# EAGLE design BBB_Learning_Board_0B (EAGLE 7.3.0)
Learning board for the BeagleBone Black.
REV: 0A
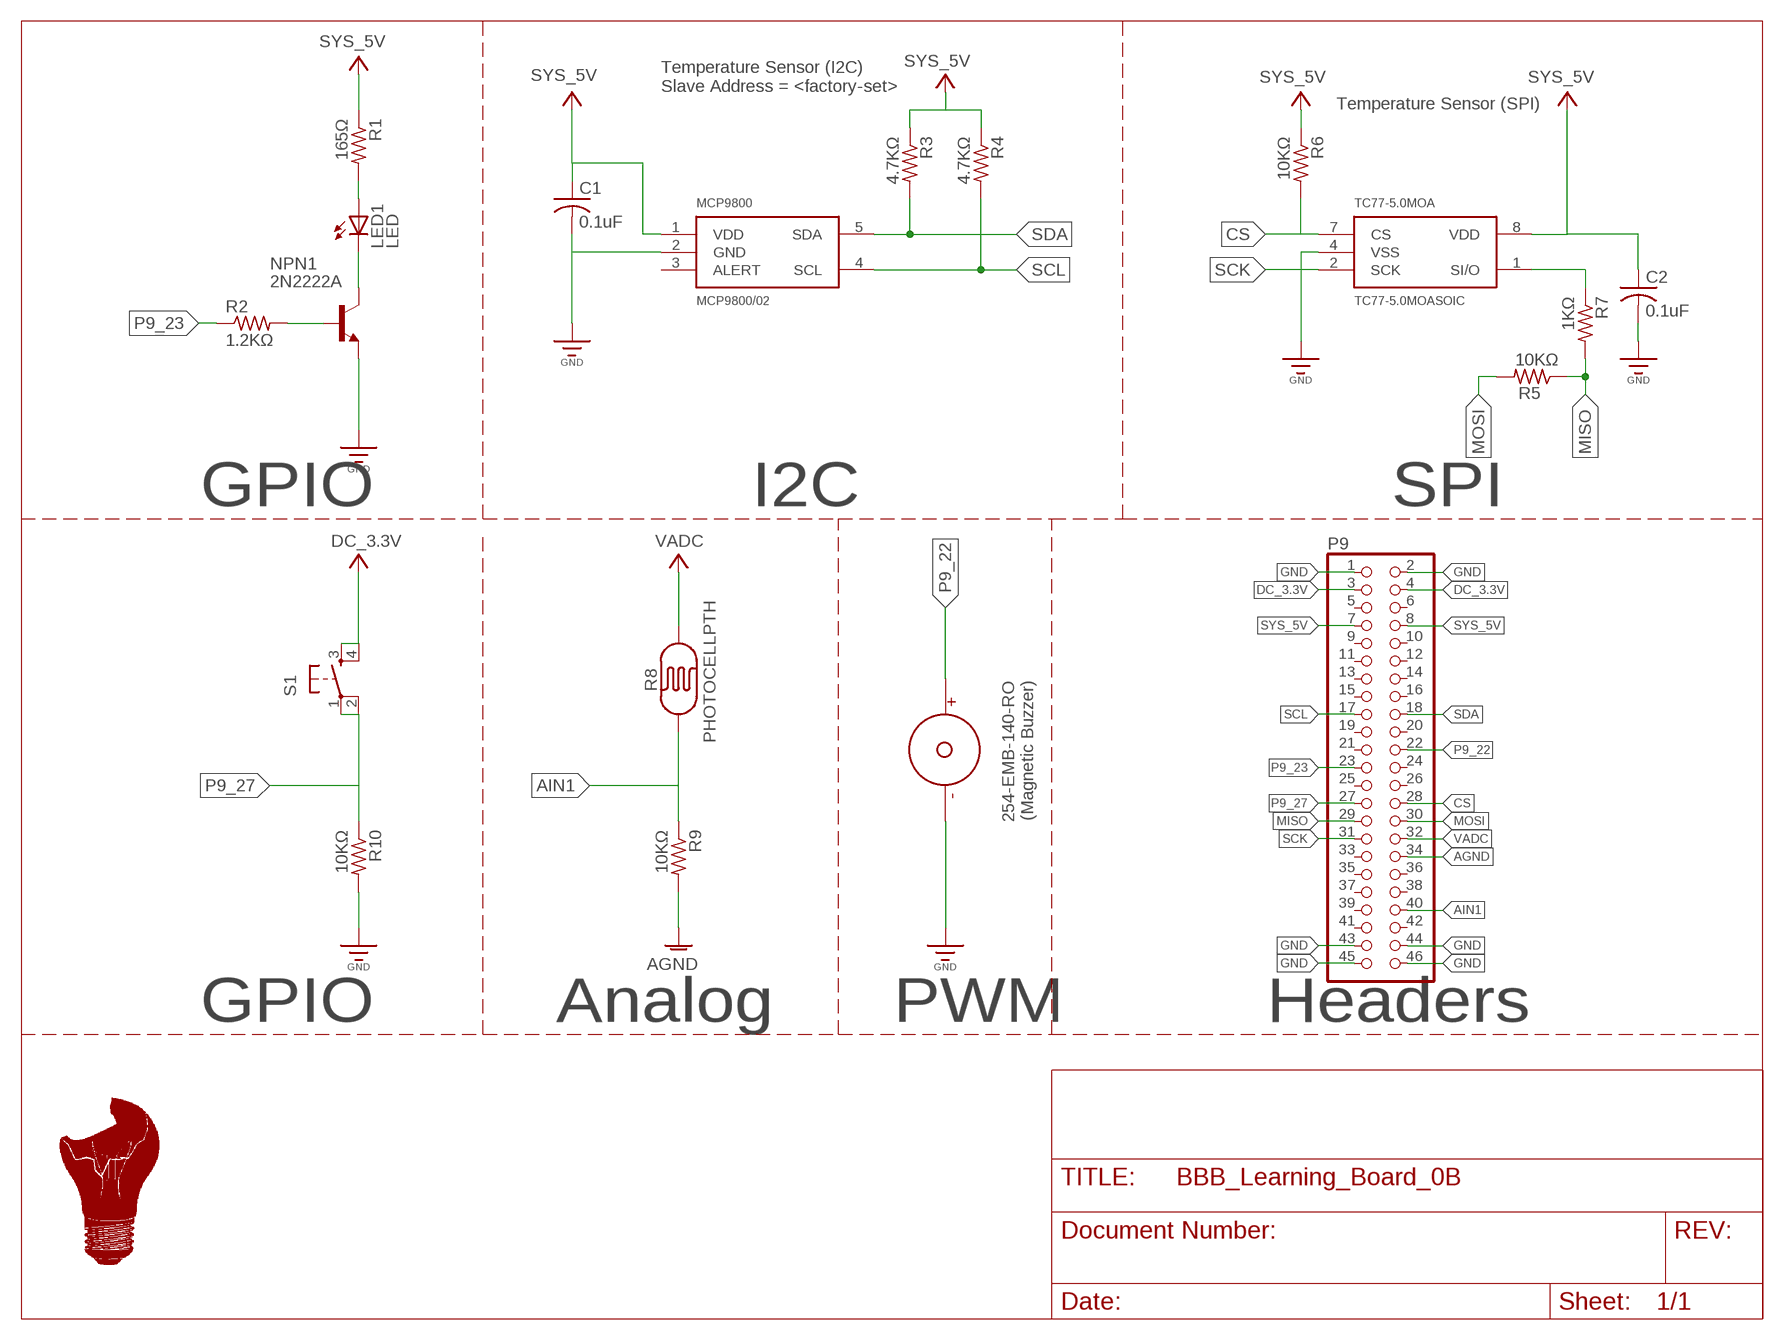
[diagram p0: schematic, sheet 1]

## Parts
C1  0.1uF  C-USC0805  [C0805]
C2  0.1uF  C-USC0805  [C0805]
LED1  LED  [LED5MM]
MCP9800  MCP9800/02  [SOT23-5]
NPN1  2N2222A  [PINHD-1X3]
P9  PINHD-2X23  [2X23]
R1  165Ω  R-US_R0805  [R0805]
R2  1.2KΩ  R-US_R0805  [R0805]
R3  4.7KΩ  R-US_R0805  [R0805]
R4  4.7KΩ  R-US_R0805  [R0805]
R5  10KΩ  R-US_R0805  [R0805]
R6  10KΩ  R-US_R0805  [R0805]
R7  1KΩ  R-US_R0805  [R0805]
R8  PHOTOCELLPTH  [PHOTOCELL]
R9  10KΩ  R-US_R0805  [R0805]
R10  10KΩ  R-US_R0805  [R0805]
S1  TAC_SWITCHPTH  [TACTILE-PTH]
TC77-5.0MOA  TC77-5.0MOASOIC  [SOIC-8]
U$6  254-EMB-140-RO  [254-EMB-140-RO]
U$7  LIGHTBULB_LOGOBOTTOM  [LIGHTBULB_LOGO_BOTTOM-2_54CM2]

## Nets
AGND: P9.34 R9.2
AIN1: P9.40 R8.1 R9.1
CS: P9.28 R6.2 TC77-5.0MOA.7(CS)
DC_3.3V: P9.3 P9.4 S1.3 S1.4
GND: C1.2 C2.2 MCP9800.2(GND) NPN1.1(E) P9.1 P9.2 P9.43 P9.44 P9.45 P9.46 R10.2 TC77-5.0MOA.4(VSS) U$6.NEGATIVE
MISO: P9.29 R5.1 R7.2
MOSI: P9.30 R5.2
N$1: LED1.ANODE(A) R1.2
N$2: NPN1.2(B) R2.2
N$3: LED1.CATHODE(C) NPN1.3(C)
P9_22: P9.22 U$6.POSITIVE
P9_23: P9.23 R2.1
P9_27: P9.27 R10.1 S1.1 S1.2
SCK: P9.31 TC77-5.0MOA.2(SCK)
SCL: MCP9800.4(SCL) P9.17 R4.2
SDA: MCP9800.5(SDA) P9.18 R3.2
SI/O: R7.1 TC77-5.0MOA.1(SI/O)
SYS_5V: C1.1 C2.1 MCP9800.1(VDD) P9.7 P9.8 R1.1 R3.1 R4.1 R6.1 TC77-5.0MOA.8(VDD)
VADC: P9.32 R8.2
Unconnected: MCP9800.3(ALERT) P9.5 P9.6 P9.9 P9.10 P9.11 P9.12 P9.13 P9.14 P9.15 P9.16 P9.19 P9.20 P9.21 P9.24 P9.25 P9.26 P9.33 P9.35 P9.36 P9.37 P9.38 P9.39 P9.41 P9.42

## Notes on the sheet
- Temperature Sensor (I2C)
  Slave Address = <factory-set>
- Temperature Sensor (SPI)
- GPIO | I2C | SPI
- GPIO | Analog | PWM | Headers

## Library data of the parts
C1 C2 = resistor:C-US: CAPACITOR, American symbol
LED1 = Magister-Libraries:LED
MCP9800 = Supernode-Sensors:MCP9800/02
NPN1 = Magister-Libraries:2N2222A
P9 = Magister-Libraries:PINHD-2X23
R1-R7 R9 R10 = resistor:R-US_: RESISTOR, American symbol
R8 = SparkFun-Sensors:PHOTOCELL: CdS photoresistor. This is a low cost way to detect light levels. Resistance decreases with more incoming light. SparkFun SKU: SEN-09088
S1 = SparkFun-Retired:TAC_SWITCH: Momentary Switch Button commonly used for reset or general input. Spark Fun Electronics SKU : COM-00097 SMT- SWCH-08247
TC77-5.0MOA = Magister-Libraries:TC77-5.0MOA
U$6 = Magister-Libraries:254-EMB-140-RO: Magnetic Buzzer. Audio Indicators & Alerts 12 x 8.5mm 2048Hz; CURRENT_RATING: 35mA; FREQUENCY: 2048Hz
U$7 = Magister-Libraries:LIGHTBULB_LOGO

## Board
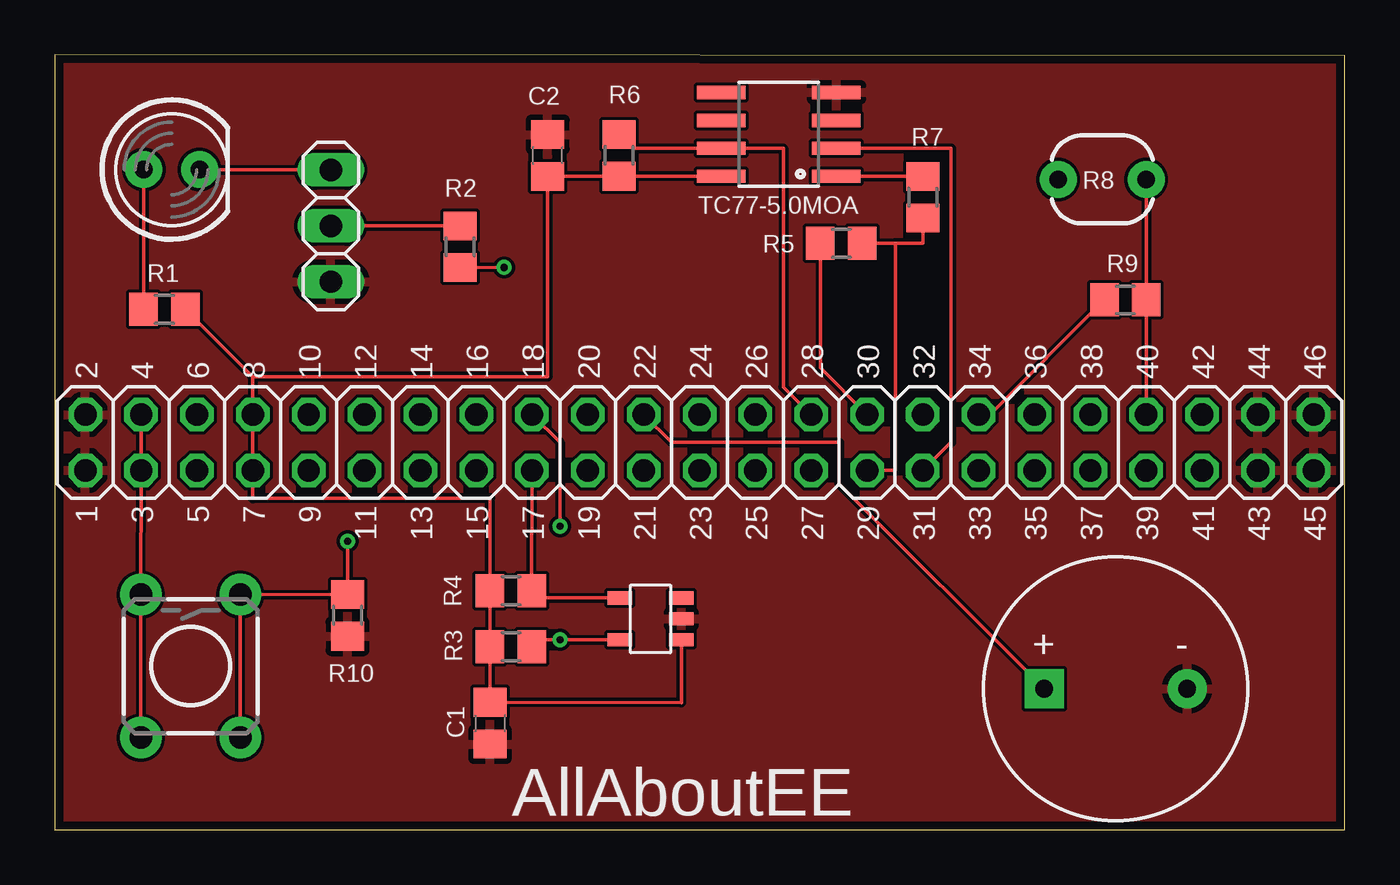
[diagram p1: board, top side]
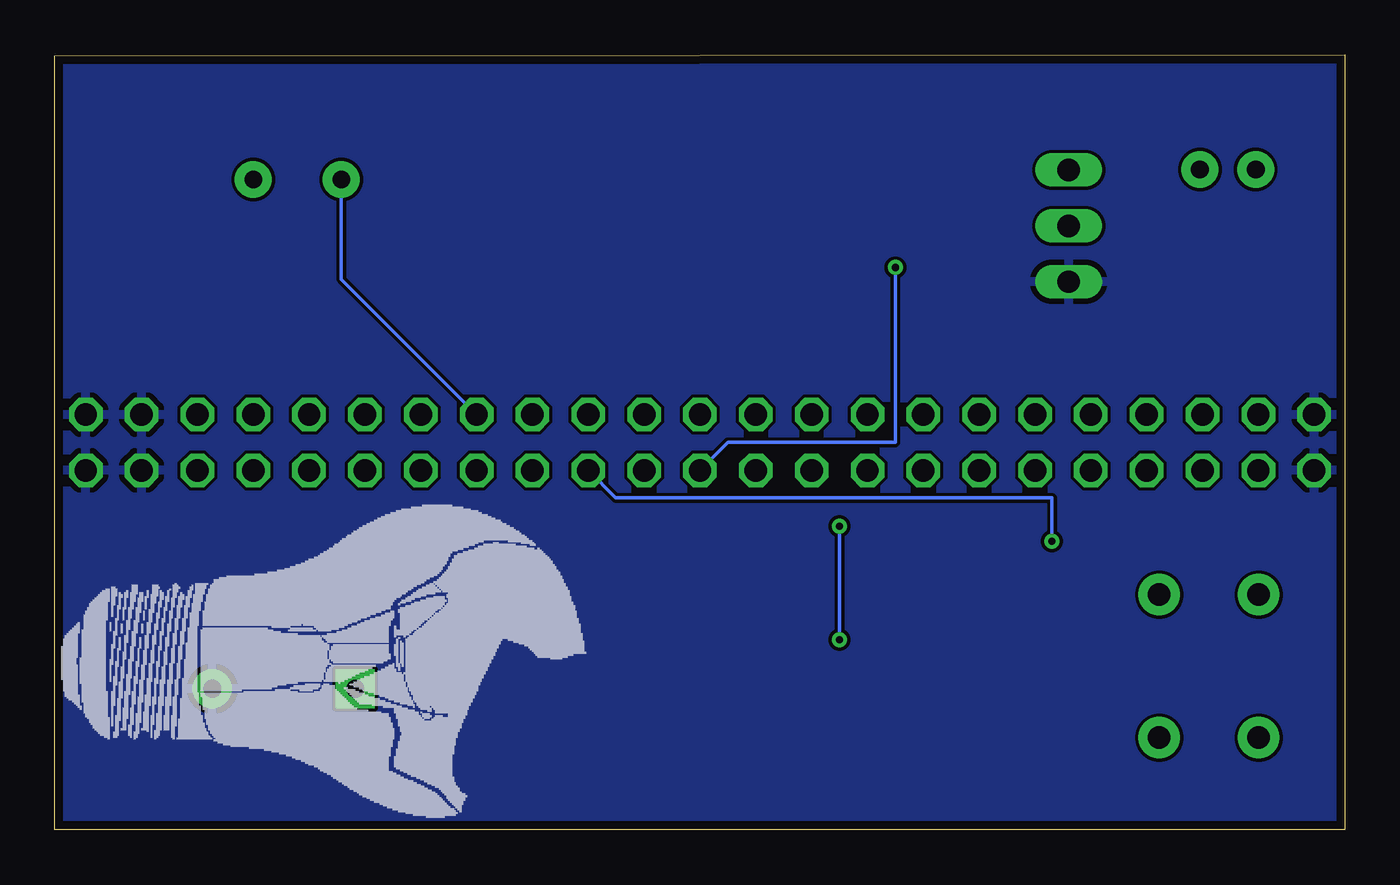
[diagram p2: board, bottom side, seen from below]

Size 58.66 x 35.23 mm. Coordinates in mm from the lower left corner, seen from the top.
Outline: 0,0 58.66,0 58.66,35.19 0,35.23 0,0
Copper layers (1*16): Top 0.0356mm / dielectric 1.5011mm / Bottom 0.0356mm
Design rules "oshpark-2layer": minimum track width 6mil, minimum drill 13mil, track to track 6mil, track to pad 6mil, pad to pad 6mil, via to via 6mil, smd to smd 6mil, copper to edge 15mil, drill to drill 6mil, minimum pad ring 7mil, minimum via ring 7mil, stop-mask expansion 2.5mil, vias tented up to drill 0mil, thermal gap 10mil

### Footprints (pad centres in the part's own frame; a part is rotated, then mirrored left to right if it is on the bottom)
C0805 = smd 1.3 x 1.5: 1 -0.95,0; 2 0.95,0
LED5MM = drill 0.813 pad 1.676: ANODE -1.27,0; CATHODE 1.27,0
SOT23-5 = smd 0.6 x 1.1: 1 -0.95,-1.4; 2 0,-1.4; 3 0.95,-1.4; 4 0.95,1.4; 5 -0.95,1.4
PINHD-1X3 = drill 1.016 long: 1 -2.54,0; 2 0,0; 3 2.54,0
2X23 = drill 1.016 octagon: 1 1.27,1.27; 2 1.27,3.81; 3 3.81,1.27; 4 3.81,3.81; 5 6.35,1.27; 6 6.35,3.81; 7 8.89,1.27; 8 8.89,3.81; 9 11.43,1.27; 10 11.43,3.81; 11 13.97,1.27; 12 13.97,3.81; 13 16.51,1.27; 14 16.51,3.81; 15 19.05,1.27; 16 19.05,3.81; 17 21.59,1.27; 18 21.59,3.81; 19 24.13,1.27; 20 24.13,3.81; 21 26.67,1.27; 22 26.67,3.81; 23 29.21,1.27; 24 29.21,3.81; 25 31.75,1.27; 26 31.75,3.81; 27 34.29,1.27; 28 34.29,3.81; 29 36.83,1.27; 30 36.83,3.81; 31 39.37,1.27; 32 39.37,3.81; 33 41.91,1.27; 34 41.91,3.81; 35 44.45,1.27; 36 44.45,3.81; 37 46.99,1.27; 38 46.99,3.81; 39 49.53,1.27; 40 49.53,3.81; 41 52.07,1.27; 42 52.07,3.81; 43 54.61,1.27; 44 54.61,3.81; 45 57.15,1.27; 46 57.15,3.81
R0805 = smd 1.3 x 1.5: 1 -0.95,0; 2 0.95,0
PHOTOCELL = drill 0.8 pad 1.676: 1 -2,0; 2 2,0
TACTILE-PTH = drill 1.016 pad 1.88: 1 -3.251,2.261; 2 3.251,2.261; 3 -3.251,-2.261; 4 3.251,-2.261
SOIC-8 = smd 0.61 x 2.21: 1 -1.905,-2.616; 2 -0.635,-2.616; 3 0.635,-2.616; 4 1.905,-2.616; 5 1.905,2.616; 6 0.635,2.616; 7 -0.635,2.616; 8 -1.905,2.616
254-EMB-140-RO = drill 0.8 pad 1.778: NEGATIVE 3.25,0 | drill 0.8 pad 1.778 square: POSITIVE -3.25,0

### Placement (x,y rotation side)
C1  19.79,4.85 270 top
C2  22.41,30.66 90 top
LED1  5.31,30.02 0 top
MCP9800  27.09,9.59 90 top
NPN1  12.55,27.46 90 top
P9  0.11,15.07 0 top
R1  4.98,23.67 180 top
R2  18.43,26.51 90 top
R3  20.74,8.32 0 top
R4  20.74,10.86 0 top
R5  35.77,26.67 180 top
R6  25.66,30.66 90 top
R7  39.48,28.76 270 top
R8  47.64,29.57 180 top
R9  48.69,24.09 180 top
R10  13.31,9.75 270 top
S1  6.17,7.44 270 top
TC77-5.0MOA  32.93,31.62 90 top
U$6  48.25,6.41 0 top
U$7  58.42,7.62 90 top

### Tracks (layer width: path | path; a pad name or v marks a point on that pad's centre or on a via)
AGND
  Top 0.152: R9.2 42.53,18.88 P9.34
AIN1
  Top 0.152: R8.1 R9.1 P9.40
CS
  Top 0.152: R6.2 26.29,30.99 TC77-5.0MOA.7 33.14,30.99 33.14,20.13 P9.28
DC_3.3V
  Top 0.152: S1.4 S1.3 P9.3 P9.4
GND
  pour Top: -2.54,-2.54 62.23,-2.54 62.23,38.1 -2.54,38.1
  pour Bottom: -5.08,-5.08 64.77,-5.08 64.77,40.64 -5.08,40.64
MISO
  Top 0.152: R7.2 39.48,26.67 38.23,26.67 | R5.1 38.23,26.67 | P9.29 38.23,16.34 38.23,26.67
MOSI
  Top 0.152: R5.2 34.81,21 P9.30
N$1
  Top 0.152: LED1.ANODE R1.2
N$2
  Top 0.152: NPN1.2 R2.2
N$3
  Top 0.152: LED1.CATHODE NPN1.3
P9_22
  Top 0.152: P9.22 28.05,17.61 35.67,17.61 35.67,15.74 U$6.POSITIVE
P9_23  (via drill 0.33)
  Top 0.152: v20.43,25.57 R2.1
  Bottom 0.152: P9.23 28.05,17.61 20.43,17.61 v20.43,25.57
P9_27  (via drill 0.33)
  Top 0.152: S1.2 S1.1 R10.1 v13.31,13.12
  Bottom 0.152: P9.27 33.15,15.09 13.31,15.09 v13.31,13.12
SCK
  Top 0.152: TC77-5.0MOA.2 40.76,30.99 40.76,17.62 P9.31
SCL
  Top 0.152: MCP9800.4 22.01,10.54 R4.2 P9.17
SDA  (via drill 0.33)
  Top 0.152: P9.18 22.97,17.61 v22.97,13.8 | MCP9800.5 v22.97,8.64 22.01,8.64 R3.2
  Bottom 0.152: v22.97,13.8 v22.97,8.64
SI/O
  Top 0.152: TC77-5.0MOA.1 R7.1
SYS_5V
  Top 0.152: MCP9800.1 28.49,5.78 C1.1 R3.1 R4.1 19.8,15.08 9,15.07 P9.7 P9.8 9,20.6 | R1.1 9,20.6 | TC77-5.0MOA.8 R6.1 C2.1 22.42,20.6 9,20.6
VADC
  Bottom 0.152: R8.2 45.64,25.04 P9.32

### Text on the board
tPlace: 2 | 4 | 6 | 8 | 10 | 12 | 14 | 16 | 18 | 20 | 22 | 24 | 26 | 28 | 30 | 32 | 34 | 36 | 38 | 40 | 42 | 44 | 46 | 1 | 3 | 5 | 7 | 9 | 11 | 13 | 15 | 17 | 19 | 21 | 23 | 25 | 27 | 29 | 31 | 33 | 35 | 37 | 39 | 41 | 43 | 45 | AllAboutEE